# Altium schematic sheet CDRon_wifi.SchDoc
size A4
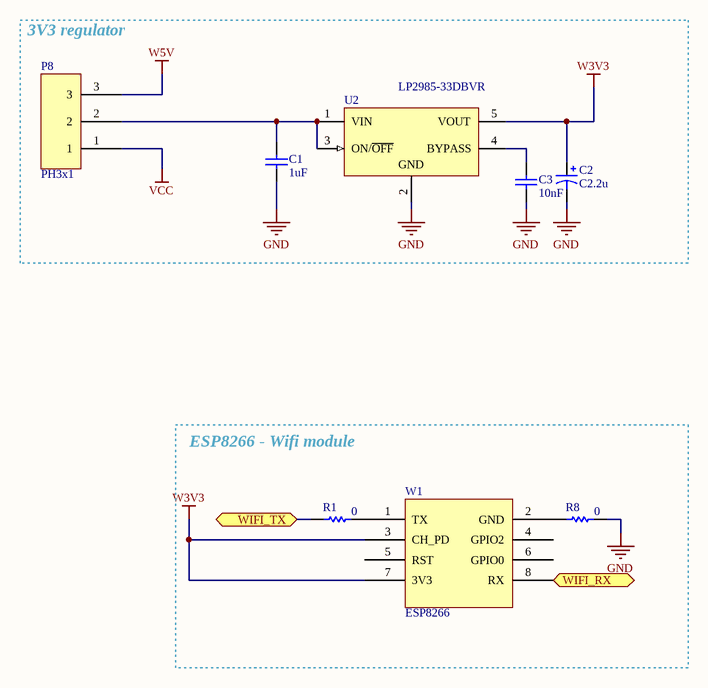
[diagram p0: CDRon_wifi.SchDoc]

## Parts
C1  value 1uF  [0805]  (hidden comment: C1u)
C2  C2.2u  [Tantalum]
C3  value 10nF  [C 1206]  (hidden comment: C10n)
P8  PH3x1  [PH3x1]
R1  0  [R 1206]
R8  0  [R 1206]
U2  LP2985-33DBVR  [TI-DBV5_N]
W1  ESP8266  [ESP8266]

## Blocks framed on the sheet
3V3 regulator: C1-C3 P8 U2
ESP8266 - Wifi module: R1 R8 W1

## Ports
WIFI_RX (in), WIFI_TX

## Nets
GND: C1.1 C2.2 C3.1 R8.2 U2.2(GND)
VCC: P8.1
W3V3: C2.1 U2.5(VOUT) W1.3(CH_PD) W1.7(3V3)
W5V: P8.3
WIFI_RX: W1.8(RX) ; port WIFI_RX
WIFI_TX: R1.1 ; port WIFI_TX
NetC1_2: C1.2 P8.2 U2.1(VIN) U2.3(ON/~{OFF})
NetC3_2: C3.2 U2.4(BYPASS)
NetR1_2: R1.2 W1.1(TX)
NetR8_1: R8.1 W1.2(GND)

Not connected (* = marked no-connect by the designer): W1 4(GPIO2) 5(RST) 6(GPIO0)

## Library data of the parts
C1 C3 = C: Cap ceramic
C2 = C Tantalum: Tantalum capacitor
R1 R8 = R: Resistencia; .Creator: SR; .PCBCheck: Used; .SCHCheck: Used; Category: Resistencias
U2 = LP2985-10DBVR: Single Output Low Noise LDO, 150 mA, Fixed 3.3 V Output, 2.2 to 16 V Input, with Low IQ, 5-pin SOT-23 (DBV), -40 to 125 degC, Green (RoHS & no Sb/Br); Manufacturer: Texas Instruments; Accuracy(%): 1.5; Fixed Output Options(V): 3.3; Iout(Max)(A): 0.15; Iq(Typ)(mA): 0.85; SubFamily: Single Channel LDO; Vdo(Typ)(mV): 280; Vin(Max)(V): 16; Vin(Min)(V): 2.2; DatasheetVersion: SLVS522N; PackageVersion: 4073253-4/K; PackageReference: DBV5; PackageDescription: 5-Pin Plastic Small Outline, Body 1.60 Ã— 2.90 mm, Pitch 0.95 mm; Eco-Plan: Green (RoHS & no Sb/Br); Vout Adj(Max)(V): 3.3; Vout Adj(Min)(V): 3.3; Mounting Technology: Surface Mount; Code_JEDEC: MO-178; PartNumber: LP2985-33DBVR; ComponentLink1Description: Manufacturer URL; ComponentLink1URL: http://www.ti.com/; ComponentLink2Description: Datasheet; ComponentLink2URL: http://www.ti.com/general/docs/lit/getliterature.tsp?genericPartNumber=LP2985-10&fileType=pdf; ComponentLink3Description: Package Specification; ComponentLink3URL: http://www.ti.com/litv/pdf/mpds018i; Supplier 1: Farnell; Supplier Part Number 1: 2412118; Supplier 2: Digi-Key; Supplier Part Number 2: 296-18476-6-ND